# EAGLE design v1 (EAGLE 6.4)
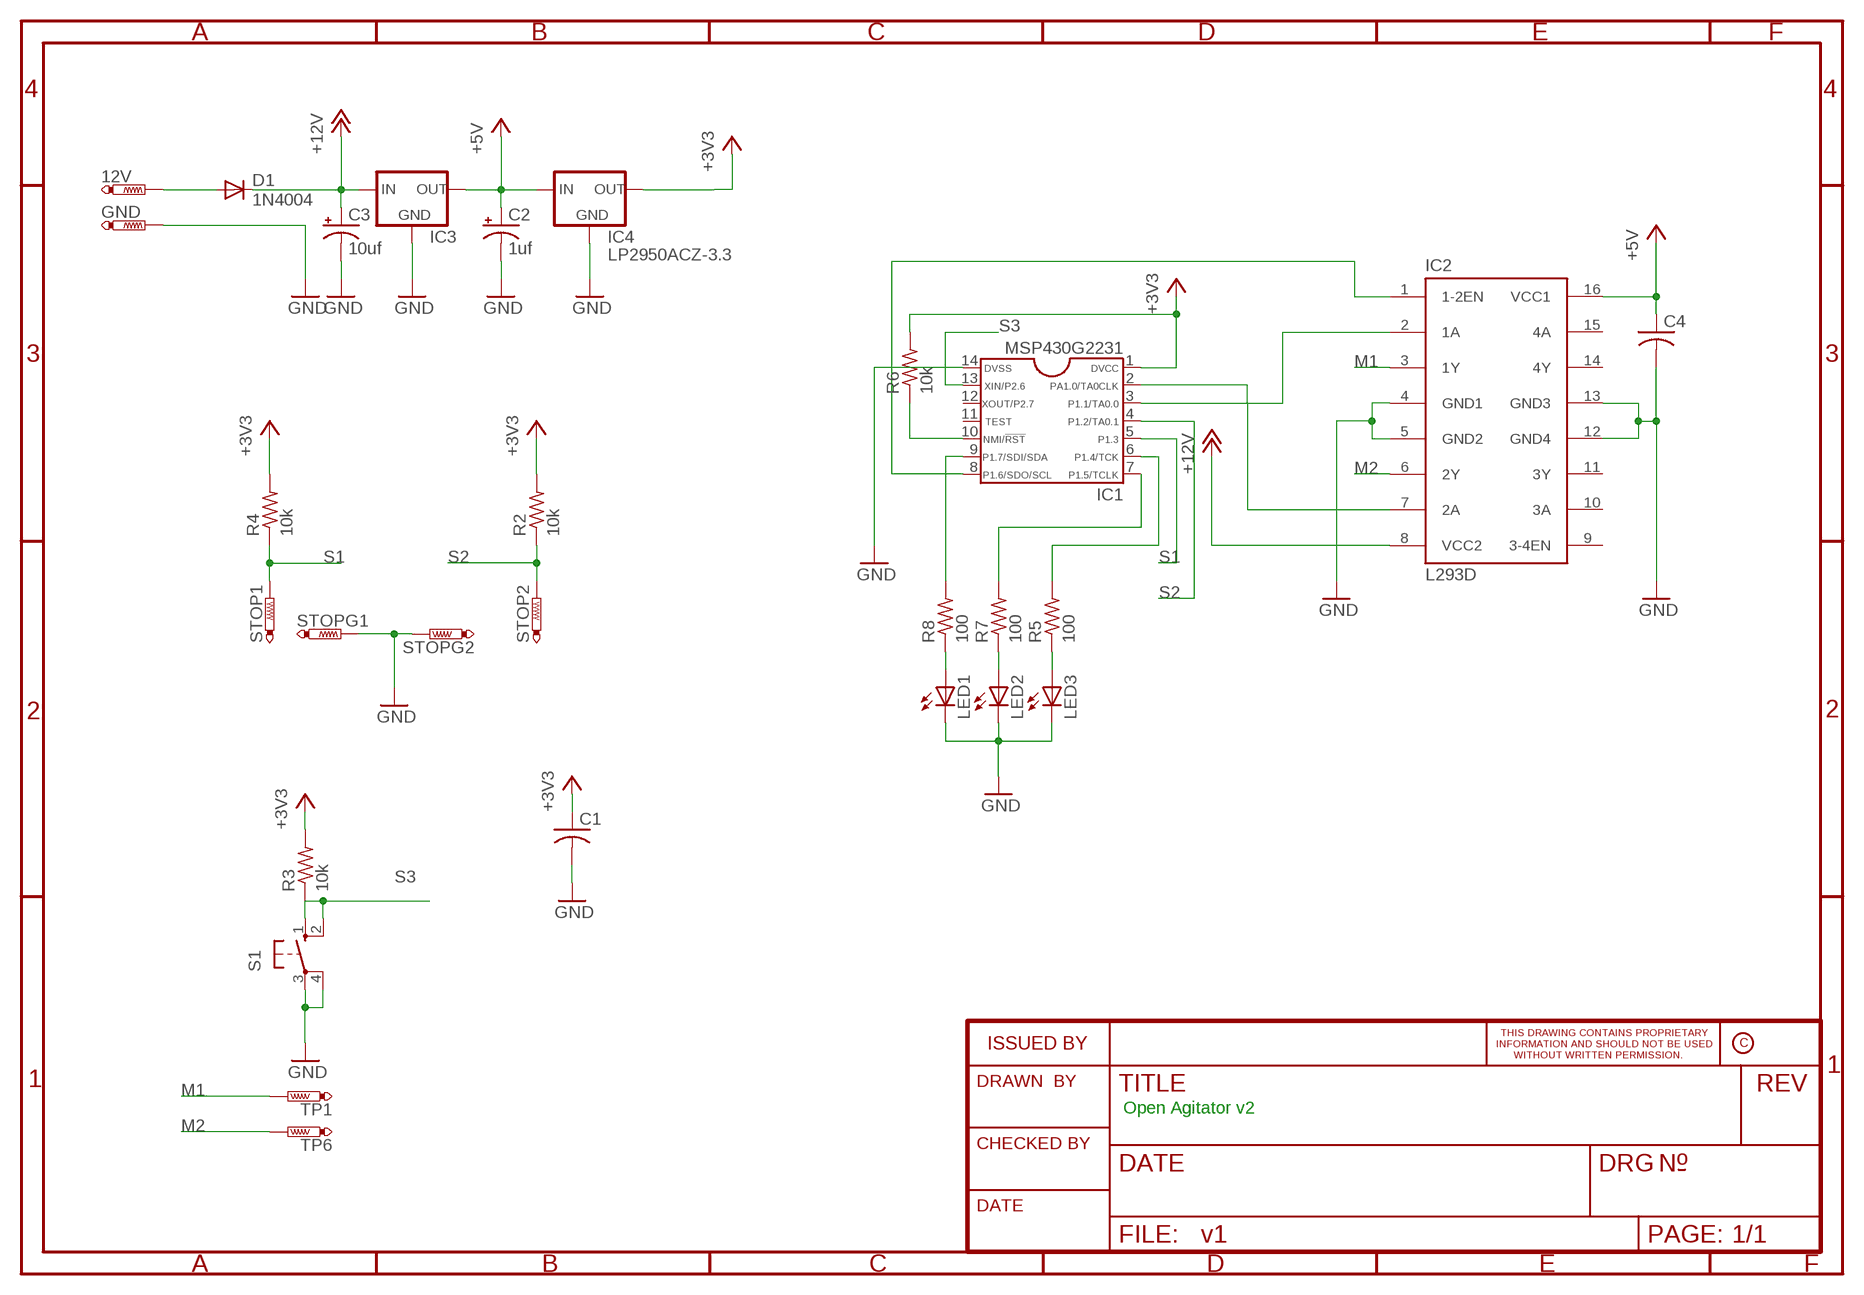
[diagram p0: schematic, sheet 1]

## Parts
12V  PTR1PAD1-13Y  [P1-13Y]
C1  CAP0805  [C0805]
C2  1uf  CPOL-USE2,5-6E  [E2,5-6E]
C3  10uf  CPOL-USE2,5-6E  [E2,5-6E]
C4  CAP0805  [C0805]
D1  1N4004  [DO41-10]
GND  PTR1PAD1-13Y  [P1-13Y]
IC1  MSP430G2231  [DIP14]
IC2  L293D  [DIL16]
IC3  V_REG_78XX-TO-220  [TO-220-ALT]
IC4  LP2950ACZ-3.3  [TO92]
LED1  LED5MM  [LED5MM]
LED2  LED5MM  [LED5MM]
LED3  LED5MM  [LED5MM]
R2  10k  RESISTOR0207/10  [0207/10]
R3  10k  RESISTOR0207/7  [0207/7]
R4  10k  RESISTOR0207/7  [0207/7]
R5  100  RESISTOR0207/7  [0207/7]
R6  10k  RESISTOR0207/7  [0207/7]
R7  100  RESISTOR0207/7  [0207/7]
R8  100  RESISTOR0207/10  [0207/10]
S1  10-XX  [B3F-10XX]
STOP1  PTR1PAD1-13Y  [P1-13Y]
STOP2  PTR1PAD1-13Y  [P1-13Y]
STOPG1  PTR1PAD1-13Y  [P1-13Y]
STOPG2  PTR1PAD1-13Y  [P1-13Y]
TP1  PTR1PAD1-13Y  [P1-13Y]
TP6  PTR1PAD1-13Y  [P1-13Y]

## Nets
+3V3: C1.1 IC1.1 IC4.1(OUT) R2.2 R3.2 R4.2 R6.2
+5V: C2.+ C4.1 IC2.16(VCC1) IC3.OUT IC4.3(IN)
+12V: C3.+ D1.C IC2.8(VCC2) IC3.IN
GND: C1.2 C2.- C3.- C4.2 GND.TP IC1.14 IC2.4(GND1) IC2.5(GND2) IC2.12(GND4) IC2.13(GND3) IC3.GND IC4.2(GND) LED1.K(C) LED2.K(C) LED3.K(C) S1.3(P) S1.4(P1) STOPG1.TP STOPG2.TP
M1: IC2.3(1Y) TP1.TP
M2: IC2.6(2Y) TP6.TP
N$1: IC1.8 IC2.1(1-2EN)
N$2: IC1.3 IC2.2(1A)
N$3: 12V.TP D1.A
N$4: IC1.2 IC2.7(2A)
N$5: IC1.10 R6.1
N$6: IC1.7 R7.2
N$7: IC1.6 R5.2
N$8: IC1.9 R8.2
N$9: LED1.A R8.1
N$10: LED2.A R7.1
N$11: LED3.A R5.1
S1: IC1.5 R4.1 STOP1.TP
S2: IC1.4 R2.1 STOP2.TP
S3: IC1.13 R3.1 S1.1(S) S1.2(S1)
Unconnected: IC1.11 IC1.12 IC2.9(3-4EN) IC2.10(3A) IC2.11(3Y) IC2.14(4Y) IC2.15(4A)

## Notes on the sheet
- Open Agitator v2

## Library data of the parts
12V GND STOP1 STOP2 STOPG1 STOPG2 TP1 TP6 = testpad:PTR1: TEST PIN
C1 C4 = CEDT:CAP
C2 C3 = rcl:CPOL-US: POLARIZED CAPACITOR, American symbol
D1 = diode:1N4004: DIODE general purpose rectifier, 1 A
IC1 = CEDT:MSP430G2231: MSP430G2231
IC2 = st-microelectronics:L293D: PUSH-PULL 4 CHANNEL DRIVER; MPN: L293D; OC_FARNELL: 9589619; OC_NEWARK: 56P8249
IC3 = SparkFun:V_REG_78XX: Voltage Regulator Standard 7805 5V regulator. IGO (Input Ground Output). Spark Fun Electronics SKU : COM-00107
IC4 = v-reg:LP2950?*: Source: http://cache.national.com/ds/LP/LP2950.pdf
LED1-LED3 = led:LED: LED OSRAM: - CHIPLED LG R971, LG N971, LY N971, LG Q971, LY Q971, LO R971, LY R971 LH N974, LH R974 LS Q976, LO Q976, LY Q976 LO Q996 - Hyper CHIPLED LW Q18S LB Q993, LB Q99A, LB R99A - SideLED LS A670, LO A670, LY A670, LG A670, LP A670 LB A673, LV A673, LT A673, LW A673 LH A674 LY A675 LS A676, LA A676, LO A676, LY A676, LW A676 LS A679, LY A679, LG A679 - Hyper Micro SIDELED® LS Y876, LA Y876, LO Y876, LY Y876 LT Y87S - SmartLED LW L88C, LW L88S LB L89C, LB L89S, LG L890 LS L89K, LO L89K, LY L89K LS L896, LA L896, LO L896, LY L896 - TOPLED LS T670, LO T670, LY T670, LG T670, LP T670 LSG T670, LSP T670, LSY T670, LOP T670, LYG T670 LG T671, LOG T671, LSG T671 LB T673, LV T673, LT T673, LW T673 LH T674 LS T676, LA T676, LO T676, LY T676, LB T676, LH T676, LSB T676, LW T676 LB T67C, LV T67C, LT T67C, LS T67K, LO T67K, LY T67K, LW E67C LS E67B, LA E67B, LO E67B, LY E67B, LB E67C, LV E67C, LT E67C LW T67C LS T679, LY T679, LG T679 LS T770, LO T770, LY T770, LG T770, LP T770 LB T773, LV T773, LT T773, LW T773 LH T774 LS E675, LA E675, LY E675, LS T675 LS T776, LA T776, LO T776, LY T776, LB T776 LHGB T686 LT T68C, LB T68C - Hyper Mini TOPLED® LB M676 - Mini TOPLED Santana® LG M470 LS M47K, LO M47K, LY M47K Source: http://www.osram.convergy.de LUXEON: - LUMILED® LXK2-PW12-R00, LXK2-PW12-S00, LXK2-PW14-U00, LXK2-PW14-V00 LXK2-PM12-R00, LXK2-PM12-S00, LXK2-PM14-U00 LXK2-PE12-Q00, LXK2-PE12-R00, LXK2-PE12-S00, LXK2-PE14-T00, LXK2-PE14-U00 LXK2-PB12-K00, LXK2-PB12-L00, LXK2-PB12-M00, LXK2-PB14-N00, LXK2-PB14-P00, LXK2-PB14-Q00 LXK2-PR12-L00, LXK2-PR12-M00, LXK2-PR14-Q00, LXK2-PR14-R00 LXK2-PD12-Q00, LXK2-PD12-R00, LXK2-PD12-S00 LXK2-PH12-R00, LXK2-PH12-S00 LXK2-PL12-P00, LXK2-PL12-Q00, LXK2-PL12-R00 Source: www.luxeon.com KINGBRIGHT: KA-3528ASYC Source: www.kingbright.com
R2-R8 = CEDT:RESISTOR
S1 = CEDTv66:10-XX: OMRON SWITCH

## Board
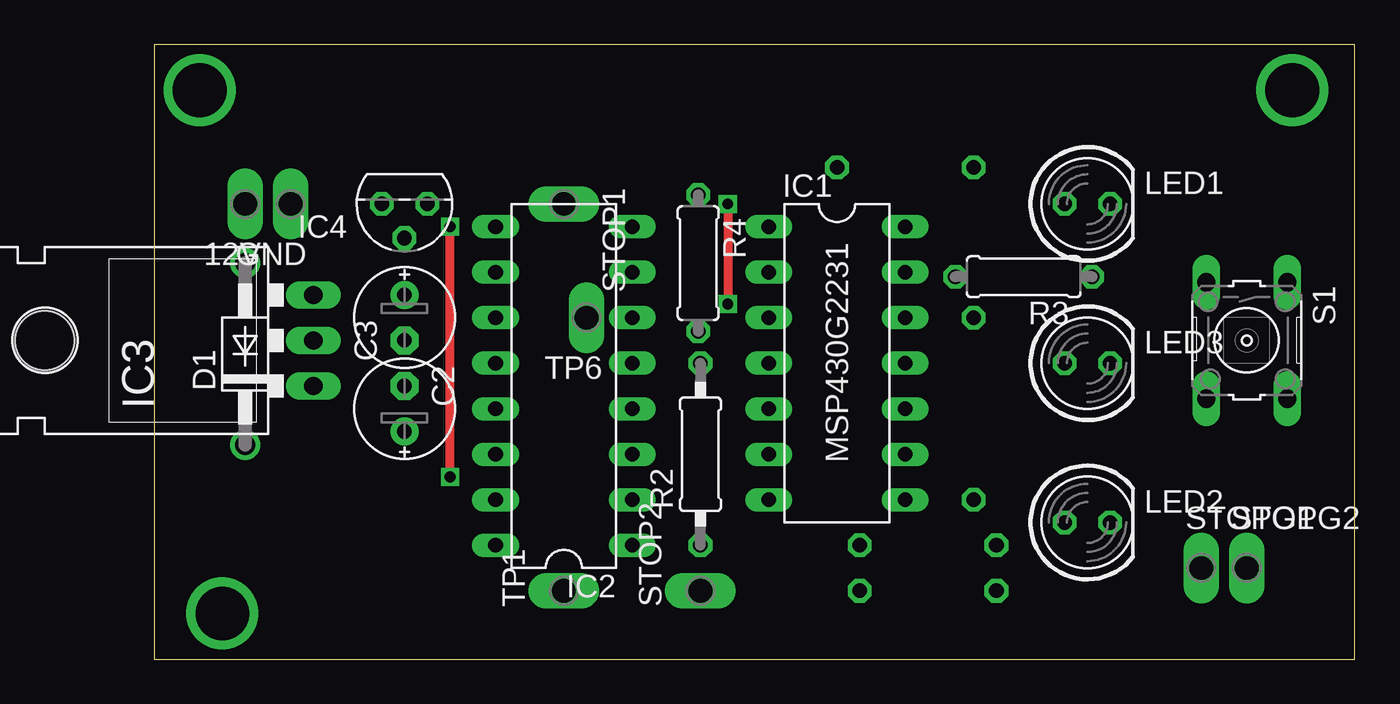
[diagram p1: board, top side]
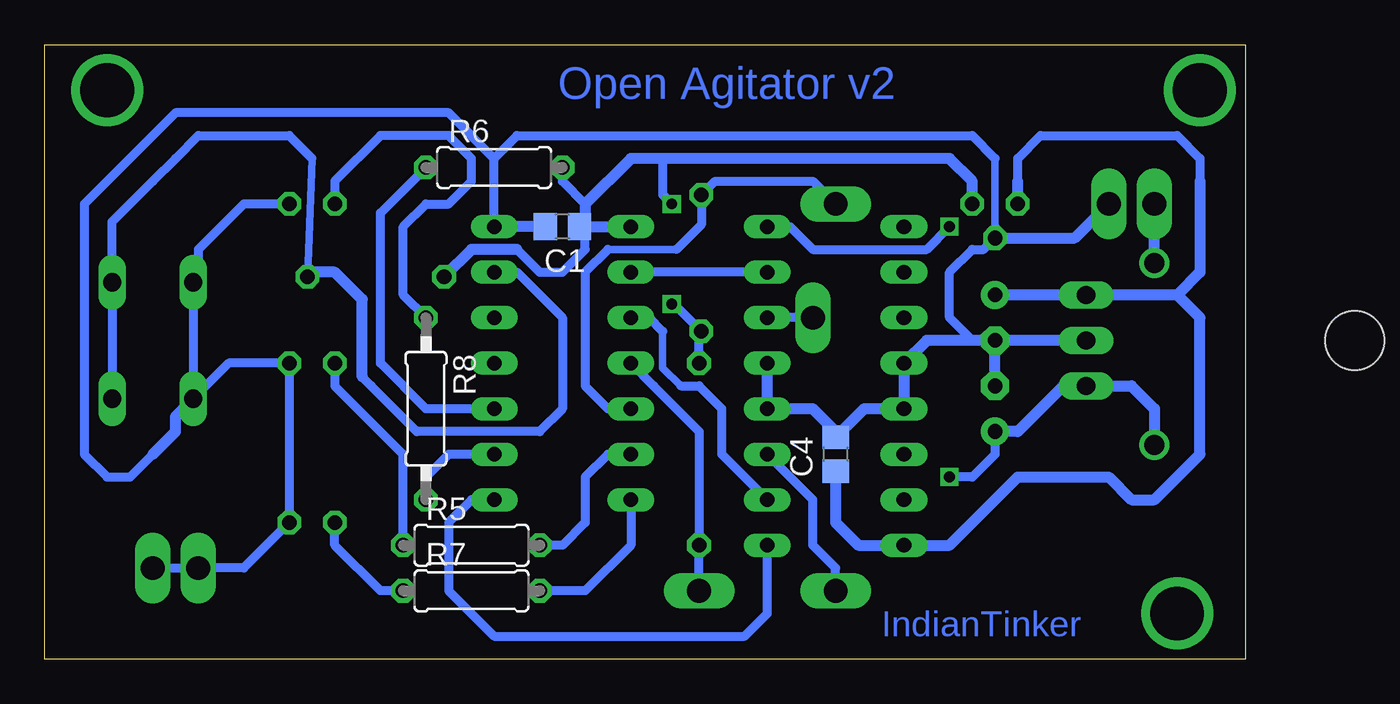
[diagram p2: board, bottom side, seen from below]

Size 66.98 x 34.28 mm. Coordinates in mm from the lower left corner, seen from the top.
Outline: 0,0 66.98,0 66.98,34.28 0,34.28 0,0
Copper layers (1*16): Top 0.035mm / dielectric 1.5mm / Bottom 0.035mm
Design rules "default": minimum track width 10mil, minimum drill 24mil, track to track 8mil, track to pad 8mil, pad to pad 8mil, via to via 8mil, smd to smd 8mil, copper to edge 40mil, drill to drill 8mil, minimum pad ring 10mil, minimum via ring 8mil, stop-mask expansion 4mil, vias tented up to drill 0mil, thermal gap 10mil

### Footprints (pad centres in the part's own frame; a part is rotated, then mirrored left to right if it is on the bottom)
P1-13Y = drill 1.321 pad 1.905 long: TP 0,0
C0805 = smd 1.3 x 1.5: 1 -0.95,0; 2 0.95,0
E2,5-6E = drill 0.813 pad 1.575: + -1.27,0 | drill 0.813 pad 1.575 octagon: - 1.27,0
DO41-10 = drill 1.118: A 5.08,0; C -5.08,0
DIP14 = drill 0.813 long: 1 -7.62,-3.81; 2 -5.08,-3.81; 3 -2.54,-3.81; 4 0,-3.81; 5 2.54,-3.81; 6 5.08,-3.81; 7 7.62,-3.81; 8 7.62,3.81; 9 5.08,3.81; 10 2.54,3.81; 11 0,3.81; 12 -2.54,3.81; 13 -5.08,3.81; 14 -7.62,3.81
DIL16 = drill 0.813 long: 1 -8.89,-3.81; 2 -6.35,-3.81; 3 -3.81,-3.81; 4 -1.27,-3.81; 5 1.27,-3.81; 6 3.81,-3.81; 7 6.35,-3.81; 8 8.89,-3.81; 9 8.89,3.81; 10 6.35,3.81; 11 3.81,3.81; 12 1.27,3.81; 13 -1.27,3.81; 14 -3.81,3.81; 15 -6.35,3.81; 16 -8.89,3.81
TO-220-ALT = drill 1.016 long: GND 0,-3.81; IN -2.54,-3.81; OUT 2.54,-3.81 | hole 3.302: 0,11.176
TO92 = drill 0.813 octagon: 1 -1.27,0; 2 0,1.905; 3 1.27,0
LED5MM = drill 0.813 octagon: A -1.27,0; K 1.27,0
0207/10 = drill 0.813 octagon: 1 -5.08,0; 2 5.08,0
0207/7 = drill 0.813 octagon: 1 -3.81,0; 2 3.81,0
B3F-10XX = drill 1.016 long: 1 -3.251,2.261; 2 3.251,2.261; 3 -3.251,-2.261; 4 3.251,-2.261

### Placement (x,y rotation side)
12V  5.08,25.4 180 top
C1  38.1,24.13 180 bottom
C2  13.97,19.05 270 top
C3  13.97,13.97 90 top
C4  22.86,11.43 90 bottom
D1  5.08,17.02 90 top
GND  7.62,25.4 180 top
IC1  38.1,16.51 270 top
IC2  22.86,15.24 90 top
IC3  5.08,17.78 90 top
IC4  13.97,25.4 180 top
LED1  52.07,25.4 0 top
LED2  52.07,7.62 0 top
LED3  52.07,16.51 0 top
R2  30.48,11.43 90 top
R3  48.51,21.34 180 top
R4  30.35,22.1 270 top
R5  43.18,6.35 0 bottom
R6  41.91,27.43 0 bottom
R7  43.18,3.81 0 bottom
R8  45.72,13.97 270 bottom
S1  60.96,17.78 270 top
STOP1  22.86,25.4 270 top
STOP2  30.48,3.81 90 top
STOPG1  58.42,5.08 0 top
STOPG2  60.96,5.08 0 top
TP1  22.86,3.81 90 top
TP6  24.13,19.05 180 top

### Tracks (layer width: path | path; a pad name or v marks a point on that pad's centre or on a via)
+3V3  (via drill 0.6)
  Top 0.508: v32,25.4 v32,19.81
  Bottom 0.508: R6.2 38.1,26.67 36.83,25.4 | R2.2 30.48,18.16 R4.2 31.88,19.81 v32,19.81 | 40.64,22.86 39.37,21.59 38.1,21.59 36.83,22.86 36.83,23.81 C1.1 | IC1.1 36.83,24.13 36.83,25.4 | 36.83,25.4 34.29,27.94 32.51,27.94 | 32.51,27.94 32,27.94 | 32,27.94 31.75,27.94 32,27.94 | 32,27.94 32.51,27.94 | 32.51,27.94 32.51,25.91 v32,25.4
  Bottom 0.61: IC4.1 15.24,26.67 16.51,27.94 31.75,27.94 32,27.94 32.51,27.94 34.29,27.94 36.83,25.4 36.83,24.45 C1.1 36.83,24.13 IC1.1 | 40.64,22.86 43.18,22.86 R3.2
+5V
  Bottom 0.508: 12.7,26.67 12.7,27.94 11.43,29.21 3.81,29.21 2.54,27.94 2.54,26.67
  Bottom 0.61: 22.86,7.62 C4.1 22.86,7.62 | 22.86,7.62 21.59,6.35 | 21.59,6.35 IC2.16 | 22.86,7.62 21.59,6.35 | 21.59,6.35 IC2.16 | IC2.16 16.51,6.35 15.24,7.62 12.7,10.16 7.62,10.16 6.35,8.89 5.08,8.89 3.81,10.16 2.54,11.43 2.54,19.05 3.81,20.32 | 3.81,20.32 IC3.OUT C2.+ | IC4.3 12.7,26.67 | 2.54,26.67 2.54,21.59 3.81,20.32
+12V  (via drill 0.6)
  Top 0.508: v16.51,10.16 v16.51,24.13
  Bottom 0.508: C3.+ 13.97,11.43 15.24,10.16 v16.51,10.16 | IC2.8 25.4,24.13 24.13,22.86 17.78,22.86 v16.51,24.13
  Bottom 0.61: D1.C 5.08,13.97 6.35,15.24 IC3.IN 10.16,15.24 12.7,12.7 C3.+
GND
  Bottom 0.406: 13.97,27.94 13.97,24.13
  Bottom 0.508: C2.- 15.24,17.78 16.51,19.05 16.51,21.59 15.24,22.86 14.61,22.86 IC4.2 13.97,24.13 | 41.91,27.94 IC1.14 41.91,27.94 | 41.91,27.94 40.64,29.21 15.24,29.21 13.97,27.94 | STOPG2.TP STOPG1.TP 55.88,5.08 LED2.K LED3.K 56.72,16.51 S1.4 S1.3 58.42,21.31 58.42,22.86 55.88,25.4 LED1.K | 41.91,27.94 44.45,30.48 59.69,30.48 64.77,25.4 64.77,11.43 63.5,10.16 62.23,10.16 60.96,11.43
  Bottom 0.61: C3.- C2.- | IC3.GND C2.- | C2.- 17.78,17.78 IC2.12 IC2.13 21.27,13.97 C4.2 22.86,12.7 24.13,13.97 25.4,13.97 IC2.4 IC2.5 | IC4.2 9.53,23.49 GND.TP | C1.2 IC1.14 | 60.96,11.43 59.69,12.7 59.69,13.54 S1.4
M1
  Bottom 0.508: TP1.TP 22.86,5.08 24.13,6.35 24.13,8.89 25.4,10.16 IC2.3
M2
  Bottom 0.508: TP6.TP IC2.6
N$1
  Bottom 0.508: IC1.8 43.18,8.89 44.45,7.62 44.45,3.81 41.91,1.27 27.94,1.27 26.67,2.54 IC2.1
N$2
  Bottom 0.406: 32.51,18.29 32.51,16.26 31.5,15.24
  Bottom 0.508: IC2.2 29.21,11.43 29.21,13.97 30.48,15.24 31.5,15.24 | IC1.3 33.27,19.05 32.51,18.29
N$3
  Bottom 0.61: D1.A 12V.TP
N$4
  Bottom 0.508: IC2.7 IC1.2
N$5
  Bottom 0.508: IC1.10 45.72,13.97 48.26,16.51 48.26,24.89 R6.1
N$6
  Bottom 0.508: IC1.7 34.29,6.35 36.83,3.81 R7.2
N$7
  Bottom 0.508: IC1.6 35.56,11.43 36.83,10.16 36.83,7.62 38.1,6.35 R5.2
N$8
  Bottom 0.508: IC1.9 44.45,11.43 45.72,10.16 R8.2
N$9
  Bottom 0.508: R8.1 46.99,20.32 46.99,24.13 45.72,25.4 44.45,25.4 43.18,26.67 43.18,27.94 44.45,29.21 48.26,29.21 50.8,26.67 LED1.A
N$10
  Bottom 0.508: R7.1 48.26,3.81 50.8,6.35 LED2.A
N$11
  Bottom 0.508: R5.1 46.99,11.43 50.8,15.24 LED3.A
N$12  (via drill 3 pad 3)
  other vias: 3.81,2.54
N$13  (via drill 3 pad 3)
  other vias: 2.54,31.75
N$14  (via drill 3 pad 3)
  other vias: 63.5,31.75
S1
  Bottom 0.406: 31.75,22.86 35.56,22.86
  Bottom 0.508: 31.75,22.86 30.35,24.26 R4.1 29.59,26.67 24.13,26.67 STOP1.TP | 35.56,22.86 36.83,21.59 36.83,15.24 35.56,13.97 IC1.5
S2
  Bottom 0.508: STOP2.TP R2.1 30.48,12.7 31.75,13.97 33.02,15.24 IC1.4
S3
  Bottom 0.406: 52.07,27.94 R3.1
  Bottom 0.508: S1.2 S1.1 63.22,24.41 60.96,26.67 59.69,27.94 58.42,29.21 53.34,29.21 52.07,27.94 | IC1.13 40.64,21.59 38.1,19.05 38.1,13.97 39.37,12.7 46.23,12.7 48.77,15.24 49.28,15.75
  Bottom 0.61: 49.28,15.75 49.28,20.07 50.8,21.59 52.07,21.59 R3.1

### Text on the board
Bottom: Open Agitator v2 | IndianTinker